# EAGLE design PCB-UHB-MIX1 (EAGLE 7.7.0)

## Sheet 1 of 2
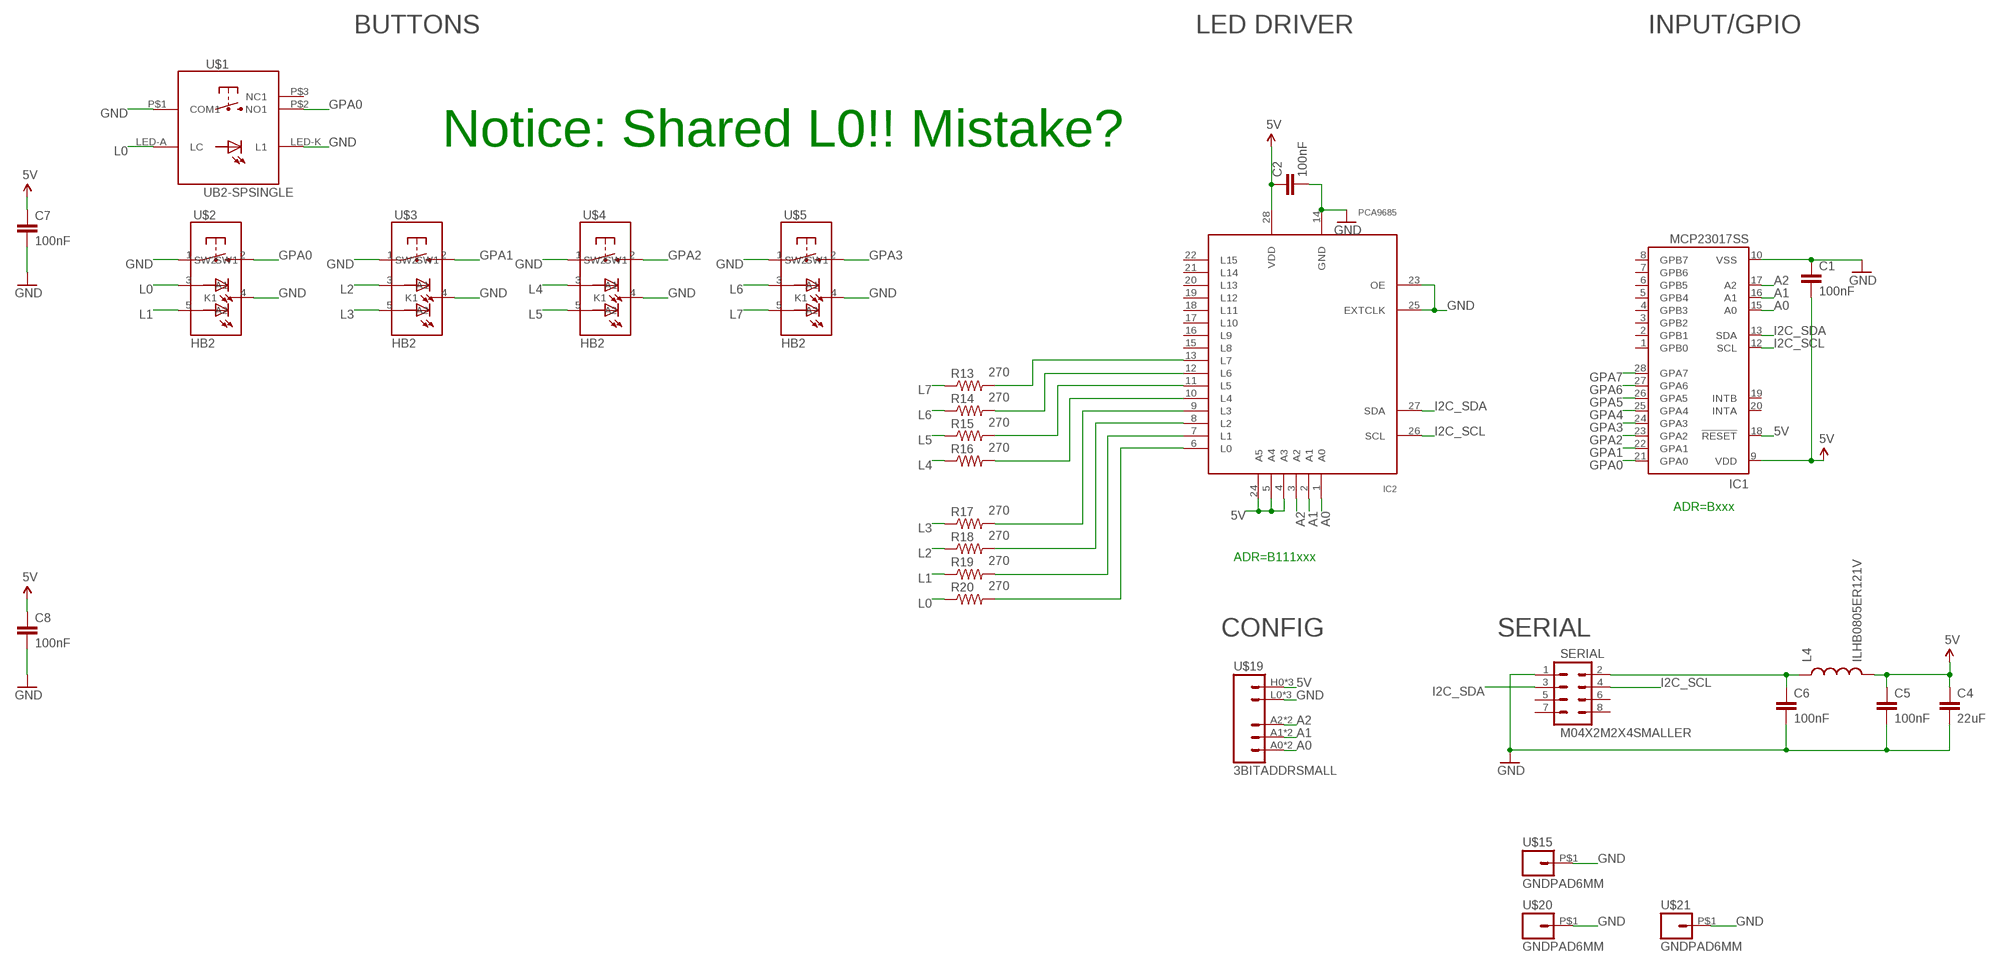
[diagram p0: schematic, sheet 1]

### Parts
C1  100nF  CAP0603-CAP  [0603-CAP]
C2  100nF  CAP0603-CAP  [0603-CAP]
C4  22uF  CAP0805  [0805]
C5  100nF  CAP0603-CAP  [0603-CAP]
C6  100nF  CAP0603-CAP  [0603-CAP]
C7  100nF  CAP0603-CAP  [0603-CAP]
C8  100nF  CAP0603-CAP  [0603-CAP]
IC1  MCP23017SS  [SSOP28]
IC2  PCA9685  [TSSOP28]
L4  ILHB0805ER121V  INDUCTOR0805  [0805]
R13  270  RESISTOR0603-RES  [0603-RES]
R14  270  RESISTOR0603-RES  [0603-RES]
R15  270  RESISTOR0603-RES  [0603-RES]
R16  270  RESISTOR0603-RES  [0603-RES]
R17  270  RESISTOR0603-RES  [0603-RES]
R18  270  RESISTOR0603-RES  [0603-RES]
R19  270  RESISTOR0603-RES  [0603-RES]
R20  270  RESISTOR0603-RES  [0603-RES]
SERIAL  M04X2M2X4SMALLER  [M2X4SMALLER]
U$1  UB2-SPSINGLE  [UB2-SPSINGLE]
U$2  HB2  [HB2]
U$3  HB2  [HB2]
U$4  HB2  [HB2]
U$5  HB2  [HB2]
U$15  GNDPAD6MM  [3.2MMPAD6MM]
U$19  3BITADDRSMALL  [3BITADDR_SMALL]
U$20  GNDPAD6MM  [3.2MMPAD6MM]
U$21  GNDPAD6MM  [3.2MMPAD6MM]

### Nets
5V [Power]: C1.2 C2.1 C4.1 C5.1 C7.1 C8.1 IC1.9(VDD) IC1.18(!RESET) IC2.4(A3) IC2.5(A4) IC2.24(A5) IC2.28(VDD) L4.2 U$19.H0(VCC) U$19.H1(VCC) U$19.H2(VCC)
A0: IC1.15(A0) IC2.1(A0) U$19.A0 U$19.AS0(A0)
A1: IC1.16(A1) IC2.2(A1) U$19.A1 U$19.AS1(A1)
A2: IC1.17(A2) IC2.3(A2) U$19.A2 U$19.AS2(A2)
GND [Power]: C1.1 C2.2 C4.2 C5.2 C6.2 C7.2 C8.2 IC1.10(VSS) IC2.14(GND) IC2.23(OE) IC2.25(EXTCLK) SERIAL.1 U$1.LED-K(L1) U$1.P$1(COM1) U$2.1(SW1) U$2.4(K1) U$3.1(SW1) U$3.4(K1) U$4.1(SW1) U$4.4(K1) U$5.1(SW1) U$5.4(K1) U$15.P$1 U$19.L0(GND) U$19.L1(GND) U$19.L2(GND) U$20.P$1 U$21.P$1
GPA0: IC1.21(GPA0) U$1.P$2(NO1) U$2.2(SW2)
GPA1: IC1.22(GPA1) U$3.2(SW2)
GPA2: IC1.23(GPA2) U$4.2(SW2)
GPA3: IC1.24(GPA3) U$5.2(SW2)
GPA4: IC1.25(GPA4)
GPA5: IC1.26(GPA5)
GPA6: IC1.27(GPA6)
GPA7: IC1.28(GPA7)
I2C_SCL: IC1.12(SCL) IC2.26(SCL) SERIAL.4
I2C_SDA: IC1.13(SDA) IC2.27(SDA) SERIAL.3
L0: R20.1 U$1.LED-A(LC) U$2.3(A1)
L1: R19.1 U$2.5(A2)
L2: R18.1 U$3.3(A1)
L3: R17.1 U$3.5(A2)
L4: R16.1 U$4.3(A1)
L5: R15.1 U$4.5(A2)
L6: R14.1 U$5.3(A1)
L7: R13.1 U$5.5(A2)
N$1 [Power]: C6.1 L4.1 SERIAL.2
N$4: IC2.13(L7) R13.2
N$5: IC2.12(L6) R14.2
N$7: IC2.11(L5) R15.2
N$9: IC2.10(L4) R16.2
N$10: IC2.9(L3) R17.2
N$11: IC2.8(L2) R18.2
N$12: IC2.7(L1) R19.2
N$19: IC2.6(L0) R20.2
Unconnected: IC1.1(GPB0) IC1.2(GPB1) IC1.3(GPB2) IC1.4(GPB3) IC1.5(GPB4) IC1.6(GPB5) IC1.7(GPB6) IC1.8(GPB7) IC1.19(INTB) IC1.20(INTA) IC2.15(L8) IC2.16(L9) IC2.17(L10) IC2.18(L11) IC2.19(L12) IC2.20(L13) IC2.21(L14) IC2.22(L15) SERIAL.5 SERIAL.6 SERIAL.7 SERIAL.8 U$1.P$3(NC1)

### Notes on the sheet
- BUTTONS | LED DRIVER | INPUT/GPIO
- Notice: Shared L0!! Mistake?
- ADR=Bxxx
- ADR=B111xxx
- CONFIG | SERIAL

## Sheet 2 of 2

## Library data of the parts
C1 C2 C4-C8 = SparkFun:CAP: Capacitor Standard 0603 ceramic capacitor, and 0.1" leaded capacitor.
IC1 = microchip:MCP23017: http://ww1.microchip.com/downloads/en/DeviceDoc/21952a.pdf Source: http://ww1.microchip.com/downloads/en/DeviceDoc/21952a.pdf; MF: MICROCHIP; MPN: MCP23017-E/SS; OC_FARNELL: 1467674; OC_NEWARK: 31K2960
IC2 = wsmith:PCA9685
L4 = SparkFun:INDUCTOR: Inductors Basic Inductor/Choke - 0603 and 1206. Footprints are not proven and vary greatly between part numbers.
R13-R20 = SparkFun:RESISTOR: Resistor Basic schematic elements and footprints for 0603, 1206, and PTH resistors.
SERIAL = SKAARHOJ:M04X2
U$1 = SKAARHOJ:UB2-SPSINGLE
U$2-U$5 = SKAARHOJ:HB2
U$15 U$20 U$21 = SKAARHOJ:GNDPAD
U$19 = SKAARHOJ:3BITADDR

## Net classes
0 default: width 0.203 mm, drill 0.406 mm, clearance 0.203 mm
1 Power: width 0.406 mm, drill 0.61 mm, clearance 0.203 mm

## Board
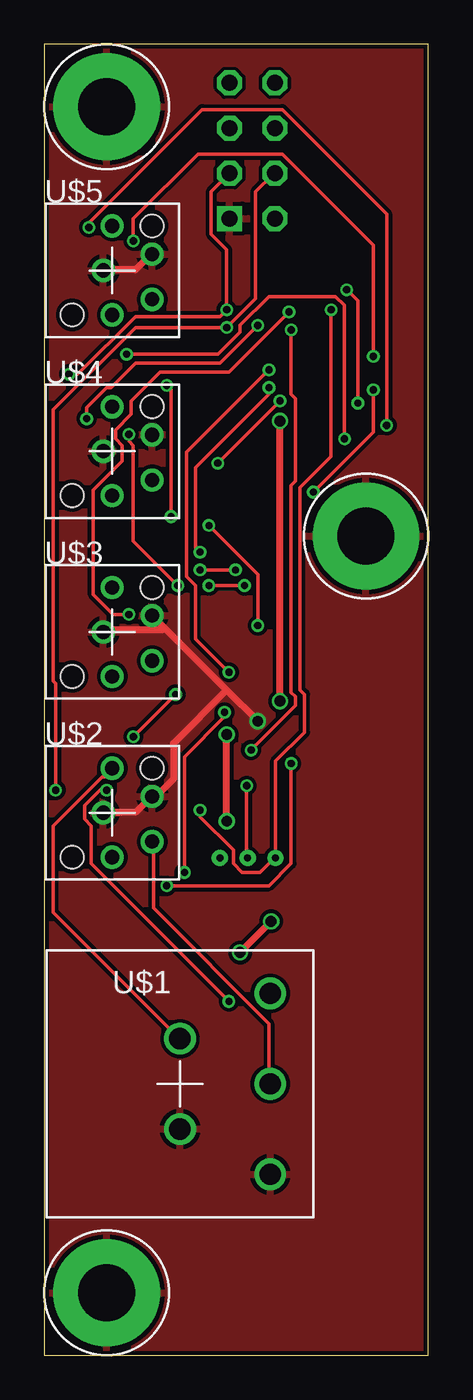
[diagram p1: board, top side]
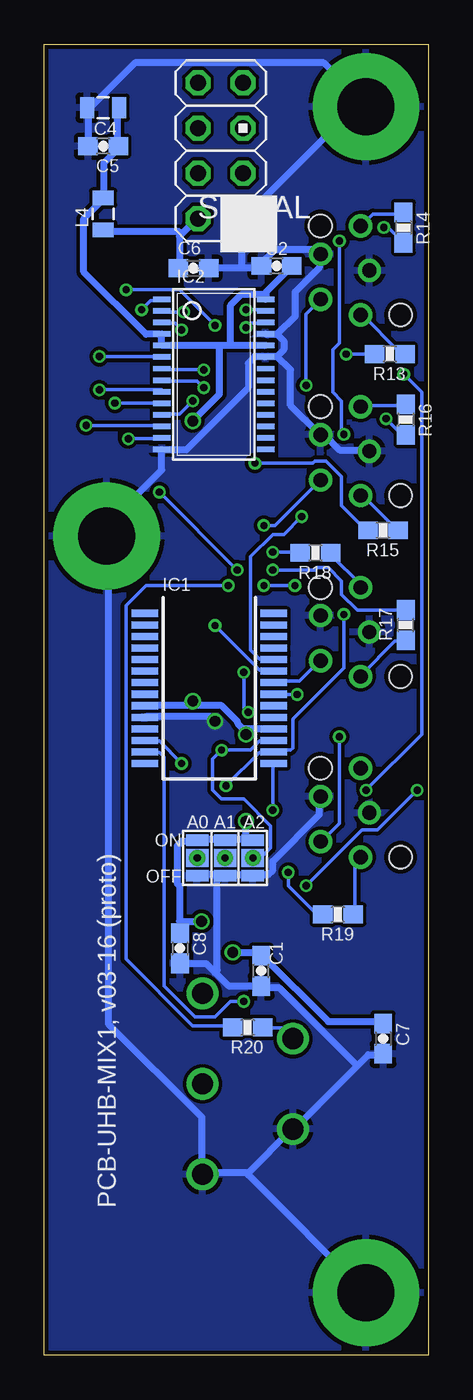
[diagram p2: board, bottom side, seen from below]

Size 21.59 x 73.66 mm. Coordinates in mm from the lower left corner, seen from the top.
Outline: 0,0 21.59,0 21.59,73.66 0,73.66 0,0
Copper layers (1*16): Top 0.035mm / dielectric 1.5mm / Bottom 0.035mm
Design rules "Fusion_eagle_rule_v1.1": minimum track width 6mil, minimum drill 12mil, track to track 6mil, track to pad 6mil, pad to pad 6mil, via to via 6mil, smd to smd 0mil, copper to edge 10mil, drill to drill 10mil, minimum pad ring 10mil, minimum via ring 6mil, stop-mask expansion 2mil, vias tented up to drill 100mil, thermal gap 10mil

### Footprints (pad centres in the part's own frame; a part is rotated, then mirrored left to right if it is on the bottom)
0603-CAP = smd 1.1 x 1: 1 -0.85,0; 2 0.85,0
0805 = smd 0.8 x 1.2: 1 -0.9,0; 2 0.9,0
SSOP28 = smd 0.4 x 1.5: 1 -4.225,-3.625; 2 -3.575,-3.625; 3 -2.925,-3.625; 4 -2.275,-3.625; 5 -1.625,-3.625; 6 -0.975,-3.625; 7 -0.325,-3.625; 8 0.325,-3.625; 9 0.975,-3.625; 10 1.625,-3.625; 11 2.275,-3.625; 12 2.925,-3.625; 13 3.575,-3.625; 14 4.225,-3.625; 15 4.225,3.625; 16 3.575,3.625; 17 2.925,3.625; 18 2.275,3.625; 19 1.625,3.625; 20 0.975,3.625; 21 0.325,3.625; 22 -0.325,3.625; 23 -0.975,3.625; 24 -1.625,3.625; 25 -2.275,3.625; 26 -2.925,3.625; 27 -3.575,3.625; 28 -4.225,3.625
TSSOP28 = smd 0.305 x 0.991: 1 -4.225,-2.918; 2 -3.575,-2.918; 3 -2.925,-2.918; 4 -2.275,-2.918; 5 -1.625,-2.918; 6 -0.975,-2.918; 7 -0.325,-2.918; 8 0.325,-2.918; 9 0.975,-2.918; 10 1.625,-2.918; 11 2.275,-2.918; 12 2.925,-2.918; 13 3.575,-2.918; 14 4.225,-2.918; 15 4.225,2.918; 16 3.575,2.918; 17 2.925,2.918; 18 2.275,2.918; 19 1.625,2.918; 20 0.975,2.918; 21 0.325,2.918; 22 -0.325,2.918; 23 -0.975,2.918; 24 -1.625,2.918; 25 -2.275,2.918; 26 -2.925,2.918; 27 -3.575,2.918; 28 -4.225,2.918
0603-RES = smd 1.1 x 1: 1 -0.85,0; 2 0.85,0
M2X4SMALLER = drill 0.9 square: 1 -1.27,3.81 | drill 0.9 octagon: 2 1.27,3.81; 3 -1.27,1.27; 4 1.27,1.27; 5 -1.27,-1.27; 6 1.27,-1.27; 7 -1.27,-3.81; 8 1.27,-3.81
UB2-SPSINGLE = drill 1.194: LED-A 0,2.54; LED-K 0,-2.54; P$1 5.08,-5.08; P$2 5.08,0; P$3 5.08,5.08
HB2 = drill 0.8: 1 2.25,0.92; 2 2.25,-1.621; 3 0,2.5; 4 -0.5,0; 5 0,-2.5 | hole 1.3: 2.25,2.5; -2.25,-2.5
3.2MMPAD6MM = drill 3.2 pad 6: P$1 0,0
3BITADDR_SMALL = drill 0.4: A0 -1.565,0; A1 0,0; A2 1.565,0 | smd 1.27 x 1: AS0 -1.565,0; AS1 0,0; AS2 1.565,0 | smd 1.27 x 0.635: H0 -1.565,1; H1 0,1; H2 1.565,1; L0 -1.565,-1; L1 0,-1; L2 1.565,-1

### Placement (x,y rotation side)
C1  9.4,21.59 90 bottom
C2  8.53,61.21 180 bottom
C4  18.29,70.1 180 bottom
C5  18.29,67.94 180 bottom
C6  13.21,61.09 0 bottom
C7  2.54,17.78 270 bottom
C8  13.97,22.86 270 bottom
IC1  12.32,37.47 270 bottom
IC2  12.06,55.12 270 bottom
L4  18.29,64.14 90 bottom
R13  2.16,56.26 180 bottom
R14  1.4,63.37 270 bottom
R15  2.54,46.35 180 bottom
R16  1.27,52.58 270 bottom
R17  1.27,41.02 90 bottom
R18  6.35,45.09 180 bottom
R19  5.08,24.77 180 bottom
R20  10.16,18.41 180 bottom
SERIAL  11.68,67.69 180 bottom
U$1  7.62,15.24 0 top
U$2  3.81,30.48 0 top
U$3  3.81,40.64 0 top
U$4  3.81,50.8 0 top
U$5  3.81,60.96 0 top
U$15  3.5,3.5 0 top
U$19  11.43,27.94 0 bottom
U$20  3.5,70.16 0 top
U$21  18.09,46.03 0 top

### Tracks (layer width: path | path; a pad name or v marks a point on that pad's centre or on a via)
5V  (via drill 0.61)
  Top 0.406: v10.25,30 v10.25,34.88 | v12.75,24.38 v11,22.62 | v13.25,36.75 v13.25,52.5
  Bottom 0.406: IC1.18 10.25,35.19 | 10.25,35.19 10.43,35.19 10.67,35.43 10.75,35.62 11.62,36.5 13.25,36.5 | C4.1 17.5,70 17.5,68 C5.1 17.5,67.75 18.25,67 18.25,65.12 L4.2 18.38,64.88 19.38,63.88 19.38,60.88 15.88,57.38 15.12,57.38 IC2.4 15,57.38 15,56.88 IC2.5 14.88,56.75 11.75,56.75 | 9.12,59.62 9.12,59.75 7.75,61.12 C2.1 | 9.12,59.62 9.12,59.38 IC2.28 | 11.75,56.75 11.12,56.75 | 11.12,56.75 9.25,56.75 IC2.24 | 9.12,59.62 10.5,59.62 11.12,59 11.12,56.75 | C7.1 2.62,18.75 5.62,18.75 9.38,22.5 C1.2 9.5,22.62 v11,22.62 | 13.25,36.5 15.88,36.5 IC1.9 | 14,24.38 14,26.38 14.12,26.5 14.12,28.62 13.88,28.88 13,28.88 U$19.H0 12.88,29 11.62,29 U$19.H1 11.38,29 9.88,29 U$19.H2 10.25,29.12 v10.25,30 | 14,24.38 14,23.75 C8.1 | v10.25,34.88 10.25,35.19 | 14,24.38 v12.75,24.38 | 11.75,56.75 11.75,54 v13.25,52.5 | v13.25,36.75 13.25,36.5
A0  (via drill 0.41)
  Top 0.203: v16.12,58.75 16.12,50.5 14.38,48.75 14.38,37.38 14.62,37.12 14.62,35 13,33.38 13,28 U$19.AS0 12.88,27.88 12.12,27.12 11.12,27.12 10.62,27.62 10.62,28.38 8.75,30.25 v8.75,30.62
  Bottom 0.203: v16.12,58.75 15.62,59.25 15,59.25 IC2.1 | 13,28 U$19.AS0 | v8.75,30.62 8.75,33.12 IC1.15
A1  (via drill 0.41)
  Top 0.203: v13.75,58.62 10.38,55.25 6.5,55.25 4.88,53.62 4.88,52.88 4,52 4,51.5 4.38,51.12 4.38,50.25 2.75,48.62 2.75,42.75 3.88,41.62 v4.75,41.62 | v11.38,32 11.38,28 U$19.AS1
  Bottom 0.203: 11.5,28 U$19.AS1 | v13.75,58.62 14.88,58.62 IC2.2 | v4.75,41.62 4.75,38.62 7.62,35.75 7.62,34.12 7.75,34 8.62,34 IC1.16 8.75,33.88 9.5,33.88 v11.38,32
A2  (via drill 0.41)
  Top 0.203: v13.88,57.62 13.88,54 14.12,53.75 14.12,49.12 13.88,48.88 13.88,37.25 14.12,37 14.12,36.5 v11.62,34
  Bottom 0.203: 9.88,28 U$19.AS2 9.75,28 9.38,28 8.88,28.5 8.88,29.75 10.38,31.25 11.62,31.25 12.12,31.75 12.12,33.5 v11.62,34 10,34 9.5,34.5 8.75,34.5 IC1.17 | v13.88,57.62 14.25,58 14.88,58 IC2.3
GND  (via drill 0.61)
  Top 0.406: U$2.4 3.38,30.5 5.12,30.5 6,31.38 U$2.1 6.25,31.38 7.25,32.38 7.25,34.38 10.25,37.38 | 6.75,40.88 6.12,41.5 U$3.1 | 6.75,40.88 10.25,37.38 | 10.25,37.38 v12,35.62 | U$3.4 3.38,40.75 6.62,40.75 6.75,40.88 | U$5.4 3.38,61 5.12,61 6,61.88 U$5.1
  Bottom 0.406: v12,35.62 12.25,35.88 15.88,35.88 IC1.10 | U$19.L1 11.38,27 9.88,27 U$19.L2 9.75,27 9,27 8.75,27.25 8.75,27.75 6.12,30.38 6.12,31.38 U$2.1 | U$19.L0 12.88,27 11.62,27 U$19.L1 | 12,21.5 12.5,22 13.88,22 C8.2 | 12,21.5 11.25,20.75 9.5,20.75 C1.1 9.25,20.62 8.38,20.62 4,16.25 | U$19.L1 11.88,26.88 11.88,21.62 12,21.5 | 4,16.25 7.5,12.75 U$1.LED-K 7.75,12.62 10.12,10.25 | 4,16.25 3.38,16.88 2.62,16.88 C7.2 | 10.12,10.25 12.62,10.25 U$1.P$1 12.75,10.38 12.75,13.38 18,18.62 18,45.88 U$21.P$1 18,46.12 18,46.75 15,49.75 15,50.88 IC2.14 14.88,50.88 13.62,50.88 10.12,54.38 10.12,55.75 9.75,56.12 9.25,56.12 IC2.23 9.12,56.12 8.5,56.12 | U$15.P$1 10.12,10.12 10.12,10.25 | 8.5,56.12 8.12,56.5 8.12,57 8.5,57.38 | 8.5,57.38 9.12,57.38 IC2.25 | 8.5,56.12 7.75,55.38 7.75,53.38 6.12,51.75 U$4.1 5.88,51.75 5,50.88 3.38,50.88 U$4.4 | 10.5,61.12 12.25,61.12 C6.2 | 10.5,61.12 9.5,61.12 C2.2 9.38,61.38 8.62,62.12 6.25,62.12 6.12,62 U$5.1 6.12,61.75 6.12,61.12 7.5,59.75 7.5,58.38 8.5,57.38 | 10.5,61.12 10.5,63.88 SERIAL.1 10.25,64 3.88,70.38 U$20.P$1 3.5,70.25 5.88,72.62 16.5,72.62 19,70.12 C4.2 19.12,70 19.12,68 C5.2
  pour Top: 0,0 21.59,0 21.59,73.66 0,73.66
  pour Bottom: 0,0 21.59,0 21.59,73.66 0,73.66
GPA0  (via drill 0.41)
  Top 0.203: v5,34.75 v7.38,37.12 | U$1.P$2 12.62,15.25 12.62,18.62 6.12,25.12 6.12,28.75 U$2.2
  Bottom 0.203: v7.38,37.12 8.62,37.12 IC1.21 | v5,34.75 5,29.88 6,28.88 U$2.2
GPA1
  Bottom 0.203: IC1.22 8.62,37.88 7.25,37.88 6.12,39 U$3.2
GPA2  (via drill 0.41)
  Top 0.203: v12,41 12,43.88 v9.25,46.62
  Bottom 0.203: v12,41 9.5,38.5 8.75,38.5 IC1.23 | v9.25,46.62 8.62,46.62 6.12,49.12 U$4.2
GPA3  (via drill 0.41)
  Top 0.203: v7.12,47.12 7.12,54.25 v6.88,54.5
  Bottom 0.203: v7.12,47.12 8.12,46.12 8.75,46.12 10,44.88 10,39.62 9.5,39.12 8.75,39.12 IC1.24 | v6.88,54.5 6.88,58.5 6.12,59.25 U$5.2
I2C_SCL  (via drill 0.41)
  Top 0.203: SERIAL.4 12.88,66.38 11.88,65.38 11.88,59.38 v10.25,57.75 5.12,57.75 0.5,53.12 0.5,37.88 0.62,37.75 v0.62,31.75 | v13.88,33.25 13.88,27.62 12.62,26.38 v6.88,26.38
  Bottom 0.203: v10.25,57.75 10,58 9.25,58 IC2.26 | v13.88,33.25 15.12,34.5 15.88,34.5 IC1.12 | v6.88,26.38 3.75,29.5 2.88,29.5 v0.62,31.75
I2C_SDA  (via drill 0.41)
  Top 0.203: SERIAL.3 10.38,66.38 9.38,65.38 9.38,63 10.25,62.12 v10.25,58.75 9.88,58.38 5.12,58.38 1.88,55.12 v1.38,55.12 | v10.38,19.88 2.62,27.62 2.62,29.75 2.25,30.12 2.25,30.88 3.12,31.75 v3.5,31.75
  Bottom 0.203: v10.25,58.75 9.25,58.75 IC2.27 | v10.38,19.88 11.12,19.88 12,19 13.12,19 14.88,20.75 14.88,33.62 15.12,33.88 15.88,33.88 IC1.13 | v3.5,31.75 0.38,34.88 0.38,54.12 v1.38,55.12
L0
  Top 0.203: U$2.3 3.75,32.88 3.38,32.5 3.25,32.5 0.5,29.75 0.5,24.88 7.5,17.88 U$1.LED-A
  Bottom 0.203: R20.1 9.25,18.38 8.12,18.38 7.62,17.88 U$1.LED-A
L1
  Bottom 0.203: R19.1 4.12,24.88 4.12,27.62 3.88,27.88 U$2.5
L2
  Bottom 0.203: R18.1 5.5,45 3.75,43.25 U$3.3
L3
  Bottom 0.203: R17.1 1.38,40.12 1.88,40.12 3.75,38.25 U$3.5
L4
  Bottom 0.203: R16.1 1.38,53.38 3.75,53.38 U$4.3
L5
  Bottom 0.203: R15.1 1.75,46.38 3.75,48.38 U$4.5
L6
  Bottom 0.203: R14.1 1.5,64.12 3.12,64.12 3.75,63.5 U$5.3
L7
  Bottom 0.203: R13.1 1.38,56.38 1.62,56.38 3.75,58.5 U$5.5
N$1
  Bottom 0.406: 13.88,63 13,63.88 SERIAL.2 | 13.88,63 14,62.88 14,61.12 C6.1 | L4.1 18.25,63.12 14,63.12 13.88,63
N$4  (via drill 0.41)
  Top 0.203: v16.88,51.5 16.88,59 16.38,59.5 12.62,59.5 11,57.88 11,57.5 9.75,56.25 v4.62,56.25
  Bottom 0.203: v16.88,51.5 15,51.5 IC2.13 | v4.62,56.25 3.12,56.25 R13.2
N$5  (via drill 0.41)
  Top 0.203: v19.25,52.25 19.25,64.12 13.38,70 8.88,70 2.5,63.62 v2.5,63.38
  Bottom 0.203: v19.25,52.25 15,52.25 IC2.12 | v2.5,63.38 2.25,63.38 1.5,62.62 R14.2
N$7  (via drill 0.41)
  Top 0.203: v9.75,50.12 v13.25,53.62
  Bottom 0.203: v13.25,53.62 14,52.88 14.88,52.88 IC2.11 | v9.75,50.12 6.5,50.12 6.38,50.25 5.75,50.25 4.88,49.38 4.88,47.75 3.5,46.38 R15.2
N$9  (via drill 0.41)
  Top 0.203: v17.62,53.5 17.62,59.25 v17,59.88 | v12,57.88 9.88,55.75 5.12,55.75 3.75,54.38 3.5,54.38 2.38,53.25 v2.38,52.62
  Bottom 0.203: v17.62,53.5 15,53.5 IC2.10 | v17,59.88 14,59.88 v12,57.88 | v2.38,52.62 1.38,51.62 R16.2
N$10  (via drill 0.41)
  Top 0.203: v18.5,54.25 18.5,51.88 v15.12,48.5 | v8.75,44.12 v10.75,44.12
  Bottom 0.203: v18.5,54.25 15,54.25 IC2.9 | v10.75,44.12 v15.12,48.5 | v8.75,44.12 6.38,44.12 6.25,44.25 5.62,44.25 4.88,43.5 4.88,42.75 4,41.88 1.38,41.88 R17.2
N$11  (via drill 0.41)
  Top 0.203: v12.62,54.38 12.62,54 8.5,49.88 8.5,45.38 v8.75,45.12
  Bottom 0.203: v12.62,54.38 13,54.75 14.88,54.75 IC2.8 | v8.75,45.12 7.25,45.12 R18.2
N$12  (via drill 0.41)
  Top 0.203: v12.62,55.38 8,50.75 8,43.75 8.5,43.25 8.5,40.25 v10.38,38.38 | v10.12,36.12 10.12,35.88 7.88,33.62 v7.88,27.12
  Bottom 0.203: v12.62,55.38 14.88,55.38 IC2.7 | v10.38,38.38 10.38,36.38 v10.12,36.12 | v7.88,27.12 7.88,26.38 6.38,24.88 6,24.88 R19.2
N$19  (via drill 0.41)
  Top 0.203: v18.5,56.12 18.5,62.38 13.38,67.5 8.62,67.5 5,63.88 v5,62.62 | v4.75,51.75 4.75,51.38 5,51.12 5,45.75 v7.5,43.25 | v11.25,43.25 v9.25,43.25
  Bottom 0.203: v18.5,56.12 15,56.12 IC2.6 | v5,62.62 5,56.88 5.38,56.5 5.38,54.12 4.88,53.62 4.88,51.88 v4.75,51.75 | v9.25,43.25 v7.5,43.25 | v11.25,43.25 15.88,43.25 17,42.12 17,22.25 13.25,18.5 11.12,18.5 R20.2

### Text on the board
_bsilk: PCB-UHB-MIX1, v03-16 (proto)